# Altium project PDB26.PrjPcb (part 3 of 3)
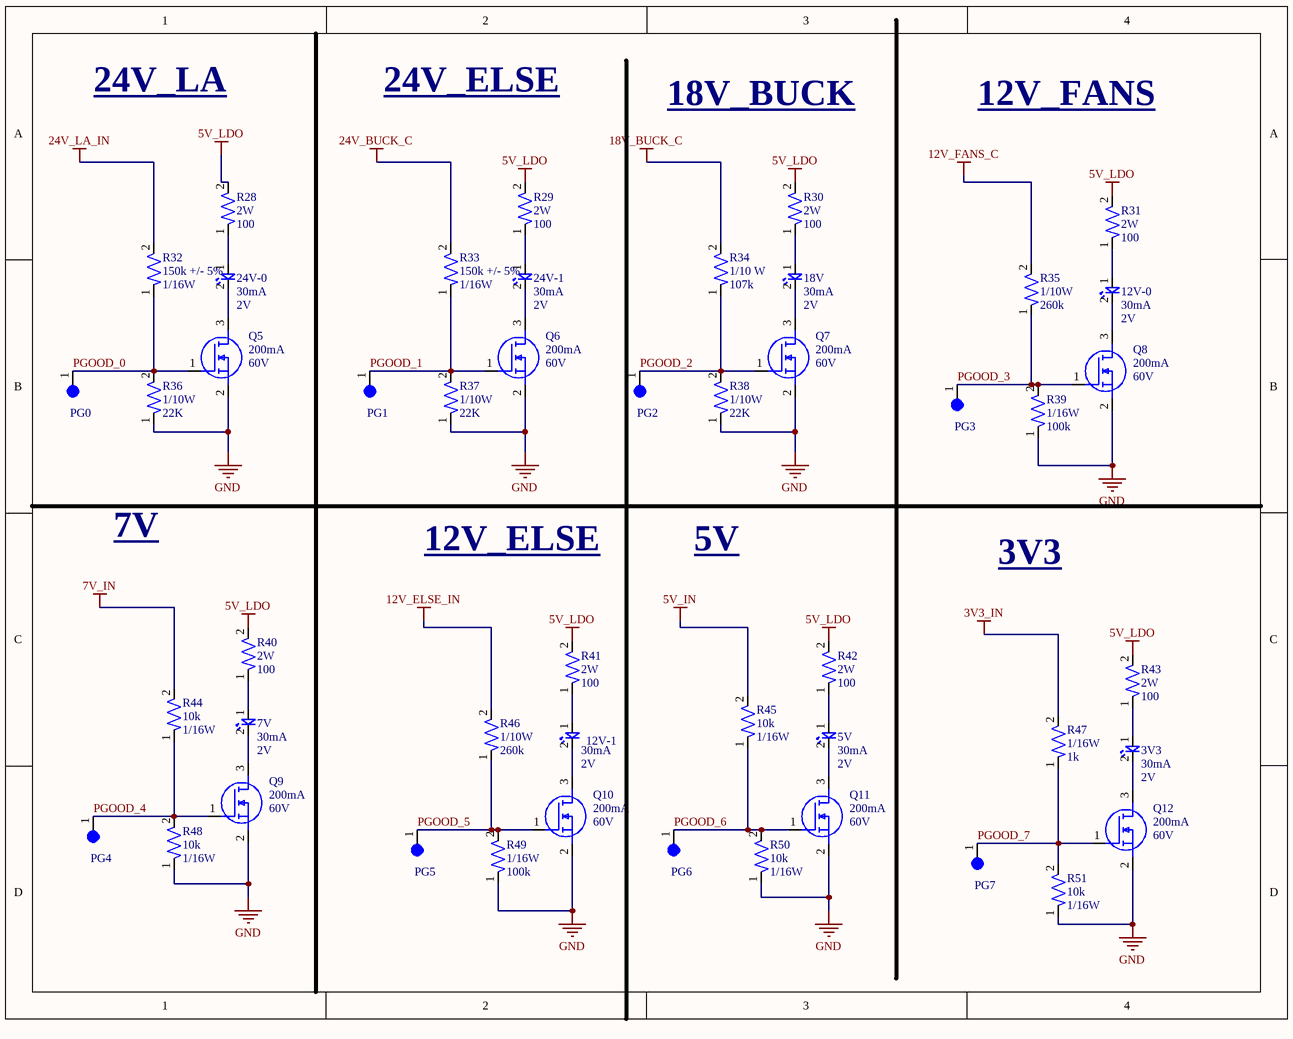
[diagram p15: PGOODs.SchDoc]

## Nets that join several sheets
3V3_AUTONLED_C: Other_Connectors (J12.1 J12.2), Current_Sensing (R8.1 U4.1)
3V3_IN: Current_Sensing (R8.2 U4.8), PGOODs (R47.2)
5V_BUCK_C: Other_Connectors (9 pins), Current_Sensing (R14.1 U7.1)
5V_IN: Other_Connectors (D14.1), Current_Sensing (R14.2 U7.8), PGOODs (R45.2)
5V_LDO: LDOs (8 pins), CAN_Transciever (U1.3), PGOODs (8 pins)
7V_BUCK_C: Current_Sensing (R13.1 U6.1), LDOs (C13.2 C15.2 I1.3 I2.3)
7V_IN: Current_Sensing (R13.2 U6.8), PGOODs (R44.2)
12V_AUTON_IN: 5V_Buck (8 pins), 3V3_Buck (9 pins)
12V_ELSE_IN: Other_Connectors (D16.1), Current_Sensing (R12.2 U5.8), PGOODs (R46.2)
12V_FANS_C: Other_Connectors (J10.1 J10.2 J30.1 J30.2), Current_Sensing (R18.1 U8.1), PGOODs (R35.2)
12V_FANS_IN: Other_Connectors (D15.1), Current_Sensing (R18.2 U8.8)
12V_FANS_OUT: 12V_Auton (7 pins), 12V_Buck_fans (15 pins)
12V_REST_C: Other_Connectors (J6.1 J6.2), Current_Sensing (R12.1 U5.1)
18V_BUCK_C: Other_Connectors (J8.1 J8.2), Current_Sensing (R7.1 U3.1), PGOODs (R34.2)
18V_IN: Other_Connectors (D12.1), Current_Sensing (R7.2 U3.8)
24V_BUCK_C: Other_Connectors (J9.1 J9.2), Current_Sensing (R6.1 U2.1), PGOODs (R33.2)
24V_BUCK_LA_C: Other_Connectors (J7.1 J7.2), Current_Sensing (R19.1 U9.1)
24V_LA_IN: Other_Connectors (D13.1), Current_Sensing (R19.2 U9.8), PGOODs (R32.2)
GND: 24V_Buck_LA (27 pins), 18V_Jetson (28 pins), 5V_Buck (28 pins), 3V3_Buck (28 pins), 12V_Auton (28 pins), 12V_Buck_fans (28 pins), 7V_Buck (28 pins), B9 (19 pins), Other_Connectors (39 pins), Current_Sensing (24 pins), LDOs (14 pins), CAN_Transciever (Q1.2 Q2.2 U1.2), B6 (19 pins), PGOODs (16 pins)
VBAT: 24V_Buck_LA (F?#1.1), 18V_Jetson (F?#3.1), 12V_Auton (F?#9.1), 12V_Buck_fans (F?#11.1), 7V_Buck (F?#13.1), Other_Connectors (5 pins)
VBAT_FUSED: 24V_Buck_LA (14 pins), 18V_Jetson (14 pins), 12V_Auton (14 pins), 12V_Buck_fans (13 pins), 7V_Buck (14 pins)
VBAT_MCU: B9 (18 pins), Current_Sensing (16 pins), LDOs (8 pins), CAN_Transciever (R4.2 R5.2 U1.5), B6 (18 pins)
AUTON_LED_B: B9 (R25_B9.1 U10_B9.42), Other_Connectors (J3.1), B6 (R25_B6.1 U10_B6.42)
AUTON_LED_G: B9 (R24_B9.1 U10_B9.43), Other_Connectors (J3.2), B6 (R24_B6.1 U10_B6.43)
AUTON_LED_R: B9 (R23_B9.1 U10_B9.44), Other_Connectors (J3.3), B6 (R23_B6.1 U10_B6.44)
CAN_N: Other_Connectors (J2.P$2 J5.P$2), CAN_Transciever (R3.2 U1.6)
CAN_P: Other_Connectors (J2.P$3 J5.P$3), CAN_Transciever (R3.1 U1.7)
CAN_RX_LED: B9 (U10_B9.30), CAN_Transciever (R2.2), B6 (U10_B6.30)
CAN_STB: B9 (U10_B9.32), CAN_Transciever (U1.8), B6 (U10_B6.32)
CAN_TX_LED: B9 (U10_B9.31), CAN_Transciever (R1.2), B6 (U10_B6.31)
CURR_3V3_BUCK: B9 (U10_B9.26), Current_Sensing (C3.1 R11.2), B6 (U10_B6.26)
CURR_5V_BUCK: B9 (U10_B9.16), Current_Sensing (C6.1 R17.2), B6 (U10_B6.16)
CURR_7V_BUCK: B9 (U10_B9.17), Current_Sensing (C5.1 R16.2), B6 (U10_B6.17)
CURR_12V_BUCK: B9 (U10_B9.11), Current_Sensing (C4.1 R15.2), B6 (U10_B6.11)
CURR_12V_BUCK_FANS: B9 (U10_B9.28), Current_Sensing (C8.1 R20.2), B6 (U10_B6.28)
CURR_18V_BUCK: B9 (U10_B9.8), Current_Sensing (C2.1 R10.2), B6 (U10_B6.8)
CURR_24V_BUCK: B9 (U10_B9.10), Current_Sensing (C1.1 R9.2), B6 (U10_B6.10)
CURR_24V_BUCK_LA: B9 (U10_B9.5), Current_Sensing (C7.1 R21.2), B6 (U10_B6.5)
FDCAN_RX: B9 (U10_B9.33), CAN_Transciever (U1.4), B6 (U10_B6.33)
FDCAN_TX: B9 (U10_B9.34), CAN_Transciever (U1.1), B6 (U10_B6.34)
RA_LASER_GND: B9 (Q3_B9.3), Other_Connectors (X1.P$1), B6 (Q3_B6.3)
SWCLK: B9 (J1_B9.06 U10_B9.38), B6 (J1_B6.06 U10_B6.38)
SWDIO: B9 (J1_B9.04 U10_B9.37), B6 (J1_B6.04 U10_B6.37)